# EAGLE design cell_3.2 (EAGLE 9.2.2)
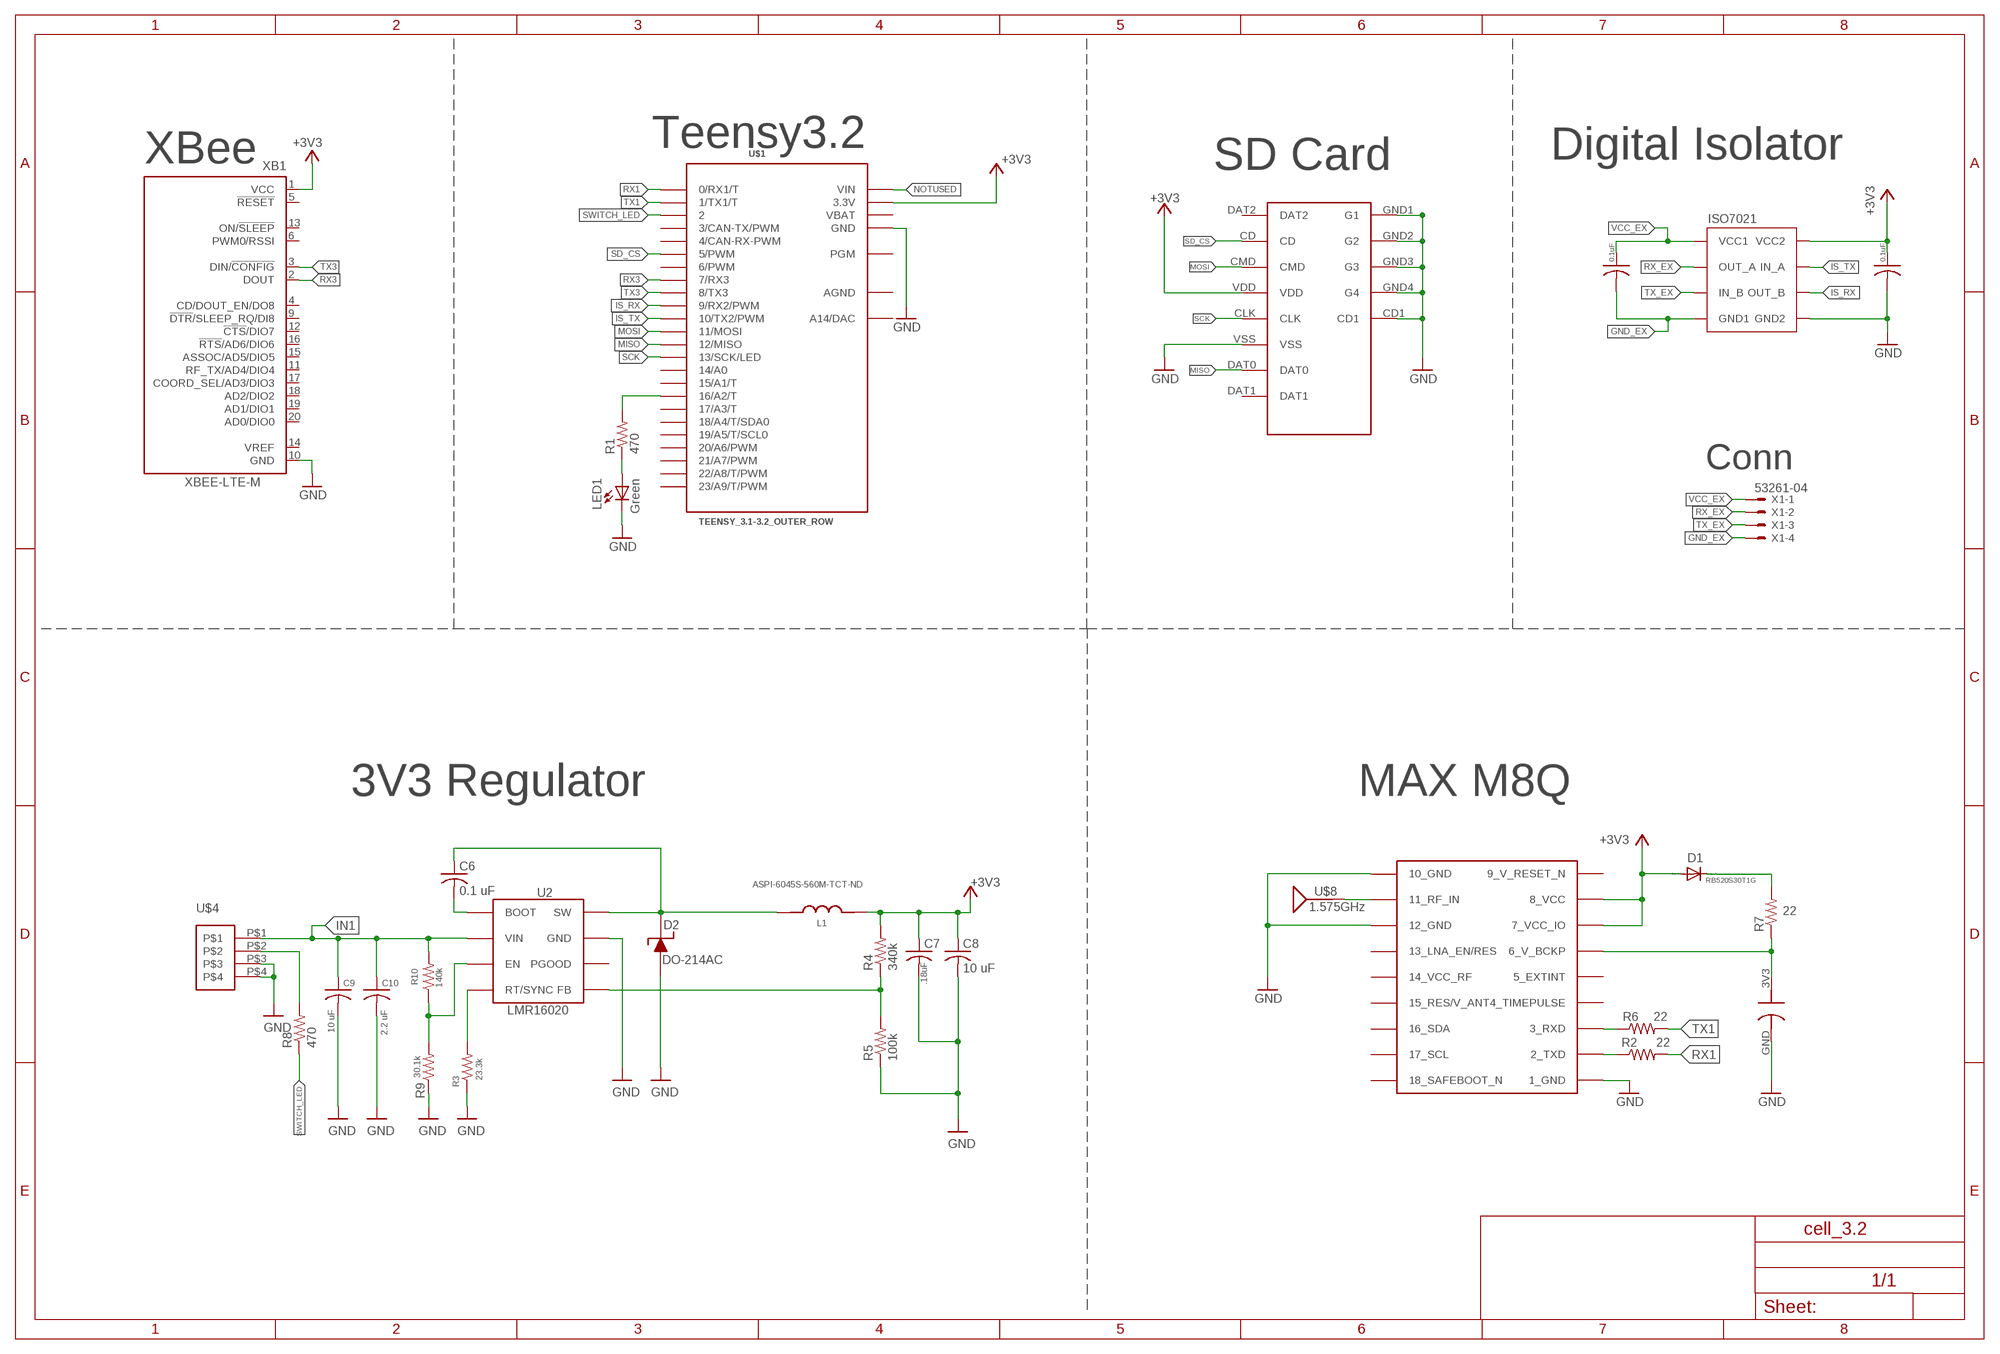
[diagram p0: schematic, sheet 1]

## Parts
C1  0.3F  DCK-3R3E204T614-E  [ELNASUPERCAP]
C2  0.1uF  C-USC0603  [C0603]
C3  0.1uF  C-USC0603  [C0603]
C6  0.1 uF  C-USC0805  [C0805]
C7  .18uF  C-USC0603  [C0603]
C8  10 uF  C-USC0603  [C0603]
C9  10 uF  C-USC1210  [C1210]
C10  2.2 uF  C-USC1210  [C1210]
D1  RB520S30T1G  DIODE-SOD523  [SOD523]
D2  DO-214AC  [DO-214AC]
ISO7021  ISO7021  [8-SOIC]
L1  ASPI-6045S-560M-TCT-ND  [ABRACON]
LED1  Green  LEDCHIP-LED0603  [CHIP-LED0603]
R1  470  R-US_R0603  [R0603]
R2  22  R-US_R0603  [R0603]
R3  23.3k  R-US_R0603  [R0603]
R4  340k  R-US_R0603  [R0603]
R5  100k  R-US_R0603  [R0603]
R6  22  R-US_R0603  [R0603]
R7  22  R-US_R0603  [R0603]
R8  470  R-US_R0603  [R0603]
R9  30.1k  R-US_R0603  [R0603]
R10  140k  R-US_R0603  [R0603]
U2  LMR16020  [SO8]
U$1  TEENSY_3.1-3.2_OUTER_ROW  [TEENSY_3.0-3.2&LC_OUTER_ROW]
U$3  MICRO_SD  [MICRO_SD_HINGED]
U$4  MICROCLASP_4  [4_PIN_MICROCLASP]
U$7  MAX-M8  [MAX-M8]
U$8  1.575GHz  SPARKFUN-GPS_ANTENNAGPS-2X7MM  [SPARKFUN-GPS_ANT-GPS-2X7MM]
X1  53261-04  [53261-04]
XB1  XBEE-LTE-M  XBEE-PRO  [XBEE-PRO]

## Nets
+3V3: C3.1 C7.1 C8.1 D1.A ISO7021.P$8(VCC2) L1.P$2 R4.2 U$1.3.3V U$1.3.3V1(3.3V) U$3.VDD U$7.7_VCC_IO U$7.8_VCC XB1.1(VCC)
EN: R9.2 R10.1 U2.P$3(EN)
FB: R4.1 R5.2 U2.P$5(FB)
GND: C1.GND C3.2 C7.2 C8.2 C9.2 C10.2 D2.P$1 ISO7021.P$5(GND2) LED1.C R3.1 R5.1 R9.1 U2.P$7(GND) U2.PAD(GND) U$1.GND U$1.GND1(GND) U$3.CD1 U$3.GND1(G1) U$3.GND2(G2) U$3.GND3(G3) U$3.GND4(G4) U$3.VSS U$4.P$3 U$4.P$4 U$7.1_GND U$7.10_GND U$7.12_GND XB1.10(GND)
GND_EX: C2.2 ISO7021.P$4(GND1) X1.4
IN1: C9.1 C10.1 R10.2 U2.P$2(VIN) U$4.P$1
IS_RX: ISO7021.P$6(OUT_B) U$1.9(9/RX2/PWM)
IS_TX: ISO7021.P$7(IN_A) U$1.10(10/TX2/PWM)
MISO: U$1.12(12/MISO) U$3.DAT0
MOSI: U$1.11(11/MOSI) U$3.CMD
N$1: U$7.11_RF_IN U$8.1(SIGNAL)
N$2: R1.2 U$1.16/A2(16/A2/T)
N$3: R6.1 U$7.3_RXD
N$4: R2.1 U$7.2_TXD
N$5: C1.3V3 R7.1 U$7.6_V_BCKP
N$6: D1.C R7.2
N$8: R3.2 U2.P$4(RT/SYNC)
N$9: C6.2 U2.P$1(BOOT)
N$10: LED1.A R1.1
N$11: R8.2 U$4.P$2
NOTUSED: U$1.VIN
RX1: R2.2 U$1.0(0/RX1/T)
RX3: U$1.7(7/RX3) XB1.2(DOUT)
RX_EX: ISO7021.P$2(OUT_A) X1.2
SCK: U$1.13(13/SCK/LED) U$3.CLK
SD_CS: U$1.5(5/PWM) U$3.CD
SW: C6.1 D2.P$2 L1.P$1 U2.P$8(SW)
SWITCH_LED: R8.1 U$1.2
TX1: R6.2 U$1.1(1/TX1/T)
TX3: U$1.8(8/TX3) XB1.3(DIN/!CONFIG)
TX_EX: ISO7021.P$3(IN_B) X1.3
VCC_EX: C2.1 ISO7021.P$1(VCC1) X1.1
Unconnected: U2.P$6(PGOOD) U$1.3(3/CAN-TX/PWM) U$1.4(4/CAN-RX-PWM) U$1.6(6/PWM) U$1.14/A0 U$1.15/A1(15/A1/T) U$1.17/A3(17/A3/T) U$1.18/A4(18/A4/T/SDA0) U$1.19/A5(19/A5/T/SCL0) U$1.20/A6(20/A6/PWM) U$1.21/A7(21/A7/PWM) U$1.22/A8(22/A8/T/PWM) U$1.23/A9(23/A9/T/PWM) U$1.PGM U$1.RESET/DAC(A14/DAC) U$3.DAT1 U$3.DAT2 U$7.4_TIMEPULSE U$7.5_EXTINT U$7.13_LNA_EN(13_LNA_EN/RES) U$7.14_VCC_RF U$7.15_V_ANT/RESERVED(15_RES/V_ANT) U$7.16_SDA U$7.17_SCL U$7.18_SAFEBOOT_N XB1.4(CD/DOUT_EN/DO8) XB1.5(!RESET) XB1.6(PWM0/RSSI) XB1.9(!DTR!/SLEEP_RQ/DI8) XB1.11(RF_TX/AD4/DIO4) XB1.12(!CTS!/DIO7) XB1.13(ON/!SLEEP) XB1.14(VREF) XB1.15(ASSOC/AD5/DIO5) XB1.16(!RTS!/AD6/DIO6) XB1.17(COORD_SEL/AD3/DIO3) XB1.18(AD2/DIO2) XB1.19(AD1/DIO1) XB1.20(AD0/DIO0)

## Notes on the sheet
- Teensy3.2 | Digital Isolator
- XBee | SD Card
- Conn
- 3V3 Regulator | MAX M8Q

## Power pins joined to a net without a drawn wire
9_V_RESET_N: U$7.9_RESET_N(9_V_RESET_N)
AGND: U$1.AGND
VBAT: U$1.VBAT

## Library data of the parts
C1 = jmolterLib:DCK-3R3E204T614-E: ELNA Supercapacitor 3.3V max DCK-3R3E204T614-E 0.2F DCK-3R3E404T614-E 0.4F
C2 C3 = rcl:C-US: CAPACITOR, American symbol; SPICEPREFIX: C
C6-C10 = resistor:C-US: CAPACITOR, American symbol
D1 = diode:DIODE-: DIODE
D2 = HASP:DO-214AC
ISO7021 = jmolterLib:ISO7021: Low Power Digital Isolater
L1 = inductors:ASPI-6045S-560M-TCT-ND
LED1 = led:LED: LED OSRAM: - CHIPLED LG R971, LG N971, LY N971, LG Q971, LY Q971, LO R971, LY R971 LH N974, LH R974 LS Q976, LO Q976, LY Q976 LO Q996 - Hyper CHIPLED LW Q18S LB Q993, LB Q99A, LB R99A - SideLED LS A670, LO A670, LY A670, LG A670, LP A670 LB A673, LV A673, LT A673, LW A673 LH A674 LY A675 LS A676, LA A676, LO A676, LY A676, LW A676 LS A679, LY A679, LG A679 - Hyper Micro SIDELED® LS Y876, LA Y876, LO Y876, LY Y876 LT Y87S - SmartLED LW L88C, LW L88S LB L89C, LB L89S, LG L890 LS L89K, LO L89K, LY L89K LS L896, LA L896, LO L896, LY L896 - TOPLED LS T670, LO T670, LY T670, LG T670, LP T670 LSG T670, LSP T670, LSY T670, LOP T670, LYG T670 LG T671, LOG T671, LSG T671 LB T673, LV T673, LT T673, LW T673 LH T674 LS T676, LA T676, LO T676, LY T676, LB T676, LH T676, LSB T676, LW T676 LB T67C, LV T67C, LT T67C, LS T67K, LO T67K, LY T67K, LW E67C LS E67B, LA E67B, LO E67B, LY E67B, LB E67C, LV E67C, LT E67C LW T67C LS T679, LY T679, LG T679 LS T770, LO T770, LY T770, LG T770, LP T770 LB T773, LV T773, LT T773, LW T773 LH T774 LS E675, LA E675, LY E675, LS T675 LS T776, LA T776, LO T776, LY T776, LB T776 LHGB T686 LT T68C, LB T68C - Hyper Mini TOPLED® LB M676 - Mini TOPLED Santana® LG M470 LS M47K, LO M47K, LY M47K Source: http://www.osram.convergy.de LUXEON: - LUMILED® LXK2-PW12-R00, LXK2-PW12-S00, LXK2-PW14-U00, LXK2-PW14-V00 LXK2-PM12-R00, LXK2-PM12-S00, LXK2-PM14-U00 LXK2-PE12-Q00, LXK2-PE12-R00, LXK2-PE12-S00, LXK2-PE14-T00, LXK2-PE14-U00 LXK2-PB12-K00, LXK2-PB12-L00, LXK2-PB12-M00, LXK2-PB14-N00, LXK2-PB14-P00, LXK2-PB14-Q00 LXK2-PR12-L00, LXK2-PR12-M00, LXK2-PR14-Q00, LXK2-PR14-R00 LXK2-PD12-Q00, LXK2-PD12-R00, LXK2-PD12-S00 LXK2-PH12-R00, LXK2-PH12-S00 LXK2-PL12-P00, LXK2-PL12-Q00, LXK2-PL12-R00 Source: www.luxeon.com KINGBRIGHT: KA-3528ASYC Source: www.kingbright.com
R1 R3-R5 R7-R10 = resistor:R-US_: RESISTOR, American symbol
R2 R6 = rcl:R-US_: RESISTOR, American symbol
U2 = HASP:LMR16020
U$1 = Teensy_3_and_LC_Series_Boards_v1.4:TEENSY_3.1-3.2_OUTER_ROW: Footprint for Teensy 3.1 or 3.2 board using all pin connections on the outer perimeter
U$3 = NR_connectors:MICRO_SD
U$4 = NR_connectors:MICROCLASP_4
U$7 = ubloxLib:MAX-M8: u-blox MAX GNSS module
U$8 = Tracksoar v2 :SPARKFUN-GPS_ANTENNA: Single-ended Antennae 1.575GHz antennae with just one terminal. These are all chip antennae. 1575MHz (GPS) Antennae ANT-GPS-2X7MM - 2.0 x 7.0 mm chip antenna. (SparkFun Product <https://www.sparkfun.com/products/9131>) ANT-GPS-2X8MM - 2.0 x 8.0 mm chip antenna. (SparkFun Product <https://www.sparkfun.com/products/8418>); PROD_ID: ANT-09087; SF_ID: GPS-09131
X1 = con-molex:53?-04: CONNECTOR wire to board 1.25 mm (.049 inch) pitch header; MF: MOLEX; OC_FARNELL: 1125374; OC_NEWARK: unknown
XB1 = maxstream:XBEE: XBee (TM) /XBee-PRO(TM) OEM RF Modules Source: MaxStream, Inc. xbee_productmanual.pdf

## Board
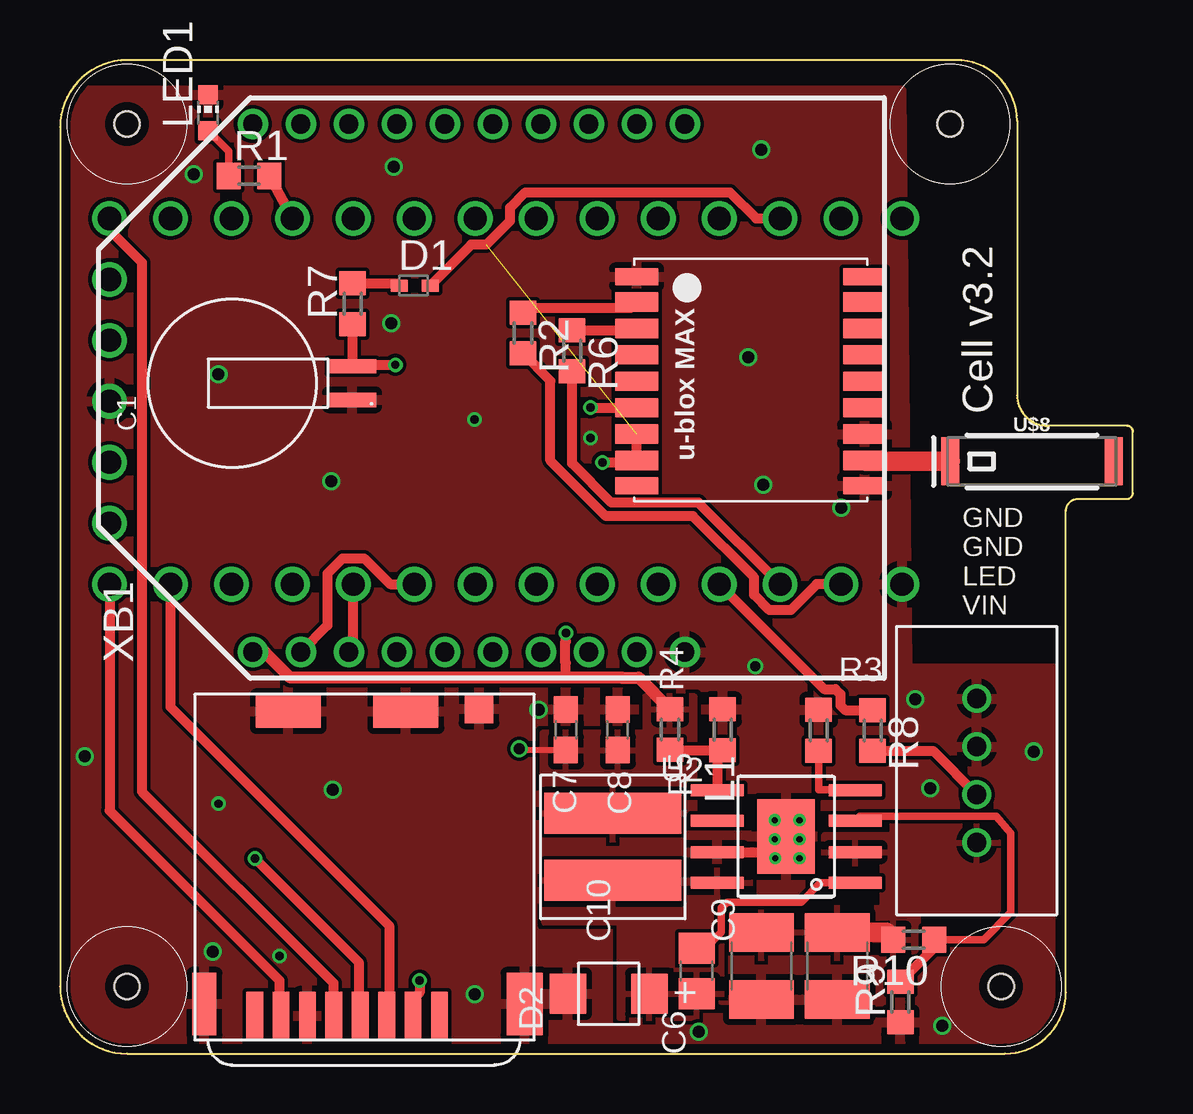
[diagram p1: board, top side]
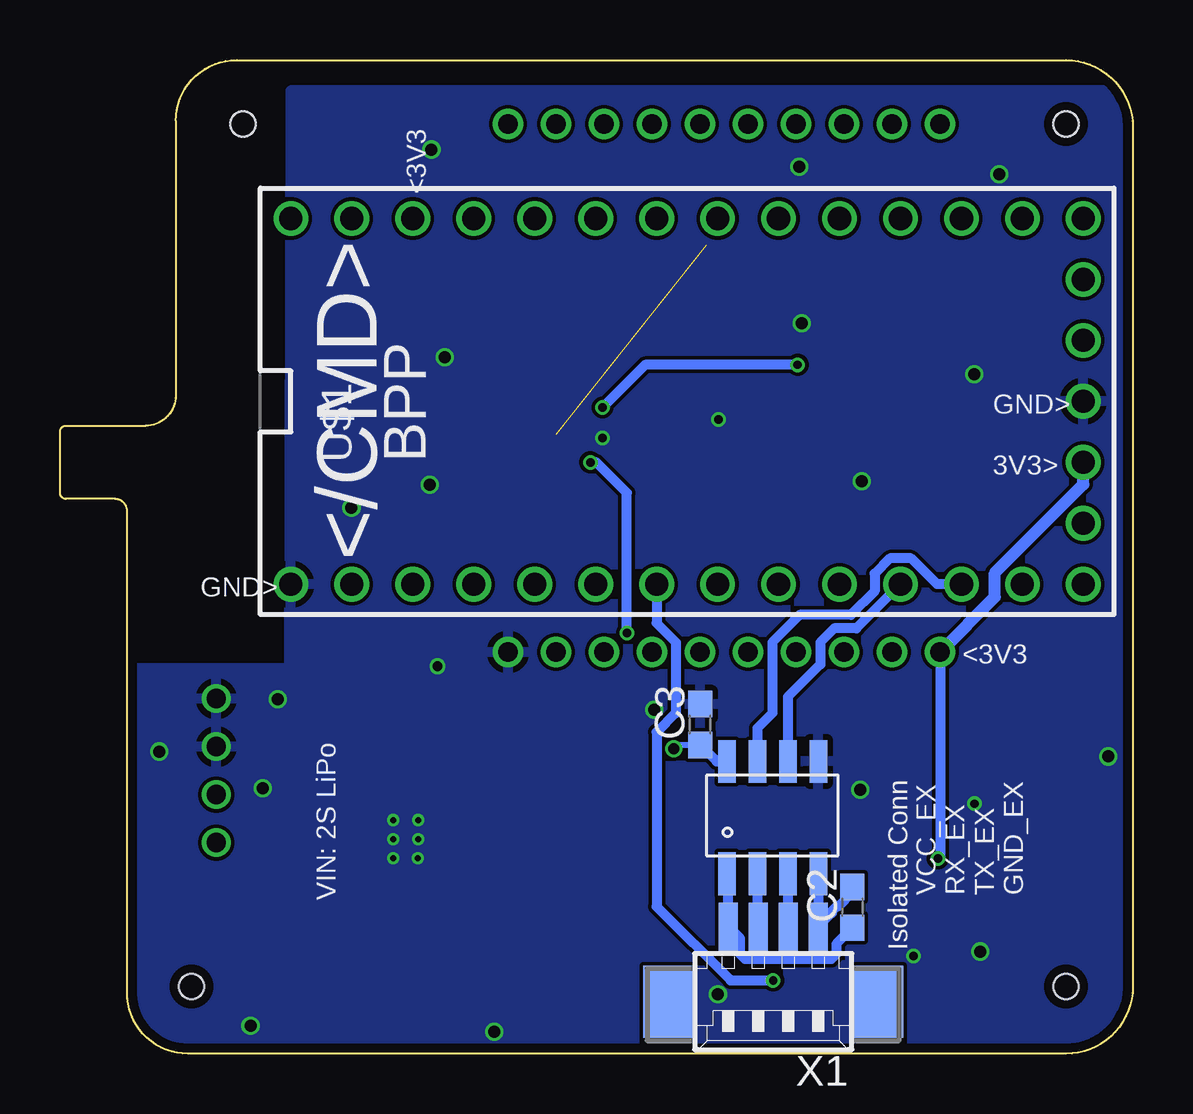
[diagram p2: board, bottom side, seen from below]

Size 44.7 x 41.4 mm. Coordinates in mm from the lower left corner, seen from the top.
Outline: 39.88,38.86 39.88,27.43 arc90 41.15,26.16 44.45,26.16 arc-90 44.7,25.91 44.7,23.37 arc-90 44.45,23.11 42.42,23.11 arc90 41.91,22.61 41.91,2.54 arc-90 39.37,0 2.79,0 arc-90 0,2.79 0,38.61 arc-90 2.79,41.4 37.34,41.4 arc-90 39.88,38.86
Copper layers (1*16): Top 0.035559375mm / dielectric 1.6mm / Bottom 0.035559375mm
Design rules "oshpark-2layer": minimum track width 6mil, minimum drill 10mil, track to track 6mil, track to pad 6mil, pad to pad 6mil, via to via 6mil, smd to smd 6mil, copper to edge 15mil, drill to drill 6mil, minimum pad ring 5mil, minimum via ring 5mil, stop-mask expansion 2.5mil, vias tented up to drill 0mil, thermal gap 10mil
Holes 1.05 mm at 2.79,38.73 37.08,38.73 2.79,2.79 39.22,2.79

### Footprints (pad centres in the part's own frame; a part is rotated, then mirrored left to right if it is on the bottom)
ELNASUPERCAP = smd 0.6 x 2: 3V3 0.7,-1.5; GND -0.7,-1.5
C0603 = smd 1.1 x 1: 1 -0.85,0; 2 0.85,0
C0805 = smd 1.3 x 1.5: 1 -0.95,0; 2 0.95,0
C1210 = smd 1.6 x 2.7: 1 -1.4,0; 2 1.4,0
SOD523 = smd 0.7 x 0.5: A 0.7,0; C -0.6,0
DO-214AC = smd 1.524 x 1.676: P$1 -1.702,0; P$2 1.702,0
8-SOIC = smd 0.72 x 1.78: P$1 0.36,0.89; P$2 1.63,0.89; P$3 2.9,0.89; P$4 4.17,0.89; P$5 4.17,5.57; P$6 2.9,5.57; P$7 1.63,5.57; P$8 0.36,5.57
ABRACON = smd 1.7 x 5.7: P$1 1.4,0; P$2 -1.4,0
CHIP-LED0603 = smd 0.8 x 0.8: A 0,-0.75; C 0,0.75
R0603 = smd 1 x 1.1: 1 -0.85,0; 2 0.85,0
SO8 = smd 0.5 x 2.2: P$1 -1.92,-2.875; P$2 -0.65,-2.875; P$3 0.65,-2.875; P$4 1.92,-2.875; P$5 1.92,2.875; P$6 0.65,2.875; P$7 -0.65,2.875; P$8 -1.92,2.875 | smd 3.1 x 2.4: PAD 0,0
TEENSY_3.0-3.2&LC_OUTER_ROW = drill 0.965: 0 -7.62,13.97; 1 -7.62,11.43; 2 -7.62,8.89; 3 -7.62,6.35; 3.3V 7.62,11.43; 3.3V1 -2.54,-16.51; 4 -7.62,3.81; 5 -7.62,1.27; 6 -7.62,-1.27; 7 -7.62,-3.81; 8 -7.62,-6.35; 9 -7.62,-8.89; 10 -7.62,-11.43; 11 -7.62,-13.97; 12 -7.62,-16.51; 13 7.62,-16.51; 14/A0 7.62,-13.97; 15/A1 7.62,-11.43; 16/A2 7.62,-8.89; 17/A3 7.62,-6.35; 18/A4 7.62,-3.81; 19/A5 7.62,-1.27; 20/A6 7.62,1.27; 21/A7 7.62,3.81; 22/A8 7.62,6.35; 23/A9 7.62,8.89; AGND 7.62,13.97; GND -7.62,16.51; GND1 0,-16.51; PGM 2.54,-16.51; RESET/DAC 5.08,-16.51; VBAT -5.08,-16.51; VIN 7.62,16.51
MICRO_SD_HINGED = smd 0.7 x 2: CD -1.1,-13.4; CLK -4.4,-13.4; CMD -2.2,-13.4; DAT0 -6.6,-13.4; DAT1 -7.7,-13.4; DAT2 0,-13.4; VDD -3.3,-13.4; VSS -5.5,-13.4 | smd 2.7 x 1.4: CD1 -1.4,-0.7; GND3 -6.3,-0.7 | smd 1.5 x 2.6: GND1 3.55,-12.9 | smd 1.2 x 1.2: GND2 1.65,-0.6 | smd 1 x 2.6: GND4 -9.8,-12.9
4_PIN_MICROCLASP = drill 0.8: P$1 -3,0; P$2 -1,0; P$3 1,0; P$4 3,0
MAX-M8 = smd 1.8 x 0.7: 1_GND 4.95,-4.4; 9_RESET_N 4.95,4.3; 10_GND -4.55,4.3; 18_SAFEBOOT_N -4.55,-4.4 | smd 1.8 x 0.8: 2_TXD 4.95,-3.35; 3_RXD 4.95,-2.25; 4_TIMEPULSE 4.95,-1.15; 5_EXTINT 4.95,-0.05; 6_V_BCKP 4.95,1.05; 7_VCC_IO 4.95,2.15; 8_VCC 4.95,3.25; 11_RF_IN -4.55,3.25; 12_GND -4.55,2.15; 13_LNA_EN -4.55,1.05; 14_VCC_RF -4.55,-0.05; 15_V_ANT/RESERVED -4.55,-1.15; 16_SDA -4.55,-2.25; 17_SCL -4.55,-3.35
SPARKFUN-GPS_ANT-GPS-2X7MM = smd 0.75 x 2: 1 -3.4,0; NC 3.4,0
53261-04 = smd 0.8 x 2: 1 1.875,-2.5; 2 0.625,-2.5; 3 -0.625,-2.5; 4 -1.875,-2.5 | smd 2.1 x 3: S1 4.375,0.625; S2 -4.375,0.625
XBEE-PRO = drill 0.8 pad 1.27: 1 -11,9; 2 -11,7; 3 -11,5; 4 -11,3; 5 -11,1; 6 -11,-1; 7 -11,-3; 8 -11,-5; 9 -11,-7; 10 -11,-9; 11 11,-9; 12 11,-7; 13 11,-5; 14 11,-3; 15 11,-1; 16 11,1; 17 11,3; 18 11,5; 19 11,7; 20 11,9

### Placement (x,y rotation side)
C1  10.67,27.94 90 top
C2  11.68,6.1 90 bottom
C3  18.03,13.72 90 bottom
C6  26.53,3.44 90 top
C7  21.08,13.49 90 top
C8  23.24,13.49 90 top
C9  32.38,3.65 270 top
C10  29.23,3.65 270 top
D1  14.73,32 0 top
D2  22.86,2.49 0 top
ISO7021  17.27,6.6 0 bottom
L1  23.03,8.62 270 top
LED1  6.17,39.2 0 top
R1  7.87,36.58 0 top
R2  19.29,30.02 270 top
R3  31.61,13.48 270 top
R4  25.42,13.51 90 top
R5  27.61,13.49 270 top
R6  21.34,29.29 270 top
R7  12.19,31.24 90 top
R8  33.86,13.46 270 top
R9  35.02,2.15 90 top
R10  35.58,4.75 180 top
U2  30.26,9.05 90 top
U$1  18.57,27.18 90 bottom
U$3  15.81,14.97 0 top
U$4  38.2,11.8 90 top
U$7  28.98,27.96 180 top
U$8  40.5,24.68 0 top
X1  14.99,2.79 180 bottom
XB1  17.03,27.73 90 top

### Tracks (layer width: path | path; a pad name or v marks a point on that pad's centre or on a via)
+3V3  (via drill 0.35, 0.45)  (1 unrouted)
  Top 0.254: C7.1 19.19,12.64 v19.14,12.7
  Top 0.406: v8.13,8.13 12.45,3.81 12.45,1.64 U$3.VDD | 23.37,15.67 23.42,15.72 | U$1.3.3V 29.01,34.8 27.92,35.89 19.39,35.89 18.75,35.25 18.75,34.7 17.76,33.71 17.13,33.71 D1.A | 21.08,15.67 21.08,16.28 21.04,16.32 21.04,17.14 21.08,17.18 v21.08,17.53 | v22.61,24.64 23.95,24.64 U$7.8_VCC U$7.7_VCC_IO
  Top 0.508: XB1.1 8.53,16.73 9.59,15.67 21.08,15.67 23.37,15.67 24.11,15.67 R4.2
  Bottom 0.254: v19.14,12.7 18.97,12.87 C3.1
  Bottom 0.406: XB1.1 8.03,8.22 v8.13,8.13 | C3.1 17.34,12.17 ISO7021.P$8 | v21.08,17.53 21.08,23.37 22.35,24.64 v22.61,24.64
  Bottom 0.508: XB1.1 5.75,19.02 5.75,20.03 2.06,23.71 U$1.3.3V1
  pour Top: 26.45,14.89 24.38,14.89 24.38,13.37 20.1,13.37 20.1,8.94 26.45,8.94
EN
  Top 0.305: U2.P$3 33.32,9.89 39,9.89 39.62,9.18 39.62,5.89 38.48,4.75 R10.1
  Top 0.406: R9.2 36.43,4.41 R10.1
FB
  Top 0.406: R4.1 25.43,12.64 R5.2 27.38,12.42 U2.P$5
GND  (via drill 0.25, 0.35, 0.41, 0.5)
  Top 0.406: U2.P$7 29.54,8.4 v29.8,8.14
  other vias: 30.81,8.14 30.81,9.73 29.78,9.73 29.78,8.94 28.67,29.02 29.31,23.7 29.23,37.67 13.91,36.96 11.3,23.84 13.8,30.43 6.6,28.31 5.57,36.64 30.81,8.94 6.37,4.25 11.37,11 19.94,14.34 35.64,14.76 40.58,12.59 32.56,22.75 28.97,16.14 9.14,4.06 6.6,10.41 17.27,26.42 36.26,11.06 36.77,1.16 26.61,0.9 1.03,12.38 22.1,25.65 17.29,2.48
  pour Bottom (rank 6): -2.29,40.13 35.11,40.13 35.18,16.05 46.05,16.05 45.97,-3.05 -2.29,-3.05
  pour Top (rank 6): -1.02,40.13 35.06,40.13 35.29,16.05 44.92,16.05 44.7,-1.78 -1.02,-1.78
GND_EX
  Bottom 0.406: ISO7021.P$4 13.1,5.3 X1.4 12.54,5.87 12.54,5.94 12.33,6.15 12.25,6.15 11.68,6.72 C2.2
IN1
  Top 0.813: R10.2 34.42,5.05 C9.1
  pour Top: 31.85,9.11 34.7,9.11 34.7,9.57 39.07,9.57 39.07,5.94 35.73,5.94 35.73,3.97 27.8,3.97 27.8,6.08 34.27,6.08 34.27,7.92 31.85,7.92
IS_RX
  Bottom 0.406: ISO7021.P$6 14.37,14.87 13.03,16.22 13.03,17.14 12.44,17.72 11.52,17.72 U$1.9
IS_TX
  Bottom 0.406: U$1.10 8.16,19.56 9.24,20.64 10.13,20.64 10.76,20.01 10.76,19.27 11.75,18.28 13.89,18.28 15.03,17.14 15.03,14.18 15.64,13.57 ISO7021.P$7
MISO
  Top 0.406: U$1.12 2.06,10.13 9.14,3.05 9.14,1.64 U$3.DAT0
MOSI
  Top 0.406: U$1.11 4.6,14.45 13.72,5.33 13.72,1.67 U$3.CMD
N$1
  Top 0.813: U$8.1 33.56,24.68 U$7.11_RF_IN
N$2
  Top 0.406: R1.2 U$1.16/A2
N$3
  Top 0.406: R6.1 23.95,30.14 U$7.3_RXD
N$4
  Top 0.406: R2.1 19.48,31.06 23.77,31.06 U$7.2_TXD
N$5  (via drill 0.35)
  Top 0.406: R7.1 12.19,28.66 C1.3V3 12.23,28.7 v13.97,28.7 | v22.1,26.92 22.11,26.91 U$7.6_V_BCKP
  Bottom 0.406: v13.97,28.7 20.32,28.7 v22.1,26.92
N$6
  Top 0.406: R7.2 14.04,32.09 D1.C
N$8
  Top 0.305: R3.2 31.61,11 33.1,11 U2.P$4
N$9
  Top 0.305: C6.2 26.91,4.39 27.56,5.05 27.56,6.08 27.8,6.32 30.89,6.32 31.69,7.11 33.12,7.11 U2.P$1
N$10
  Top 0.305: R1.1 7.02,37.6 LED1.A
N$11
  Top 0.406: R8.2 36.38,12.61 U$4.P$2
RX1
  Top 0.406: R2.2 20.44,28.03 20.44,24.71 22.75,22.4 26.37,22.4 28.92,19.85 28.92,19.11 29.56,18.48 30.45,18.48 31.53,19.56 U$1.0
RX3
  Top 0.406: U$1.7 13.75,19.56 12.67,20.64 11.78,20.64 11.14,20.01 11.14,17.84 XB1.2
RX_EX
  Bottom 0.406: ISO7021.P$2 15.64,5.33 X1.2
SCK
  Top 0.406: U$1.13 2.06,34.31 3.41,32.96 3.41,10.92 11.38,2.95 11.38,1.6 U$3.CLK
SD_CS  (via drill 0.35)
  Top 0.406: U$3.CD 14.73,1.59 14.73,2.29 14.99,2.54 v14.99,3.05
  Bottom 0.406: v14.99,3.05 16.76,3.05 19.84,6.13 19.84,13.39 19.04,14.2 19.04,17.14 19.84,17.94 U$1.5
SW
  pour Top (rank 2): 20.18,7.64 28.75,7.64 28.75,6.24 27.56,6.24 27.56,1.48 23.32,1.48 23.32,5.45 20.18,5.45
SWITCH_LED
  Top 0.406: R8.1 32.71,14.31 32.51,14.51 32.51,14.98 32.3,15.18 31.84,15.18 U$1.2
TX1
  Top 0.406: U$1.1 26.6,22.96 22.98,22.96 21.34,24.6 R6.2
TX3
  Top 0.406: U$1.8 12.22,16.92 XB1.3
TX_EX
  Bottom 0.406: ISO7021.P$3 14.37,5.3 X1.3
VCC_EX
  Bottom 0.406: ISO7021.P$1 16.86,7.44 X1.1 16.37,4.8 16.37,4.15 16.16,3.94 12.56,3.94 12.36,4.15 12.36,4.58 C2.1

### Text on the board
tPlace: Cell v3.2 | GND / GND / LED / VIN
bPlace: <3V3 | GND> | 3V3> | BPP | </CMD> | GND> | <3V3 | VIN: 2S LiPo | VCC_EX / RX_EX / TX_EX / GND_EX | Isolated Conn